# EAGLE schematic StationModule (EAGLE 7.2.0)
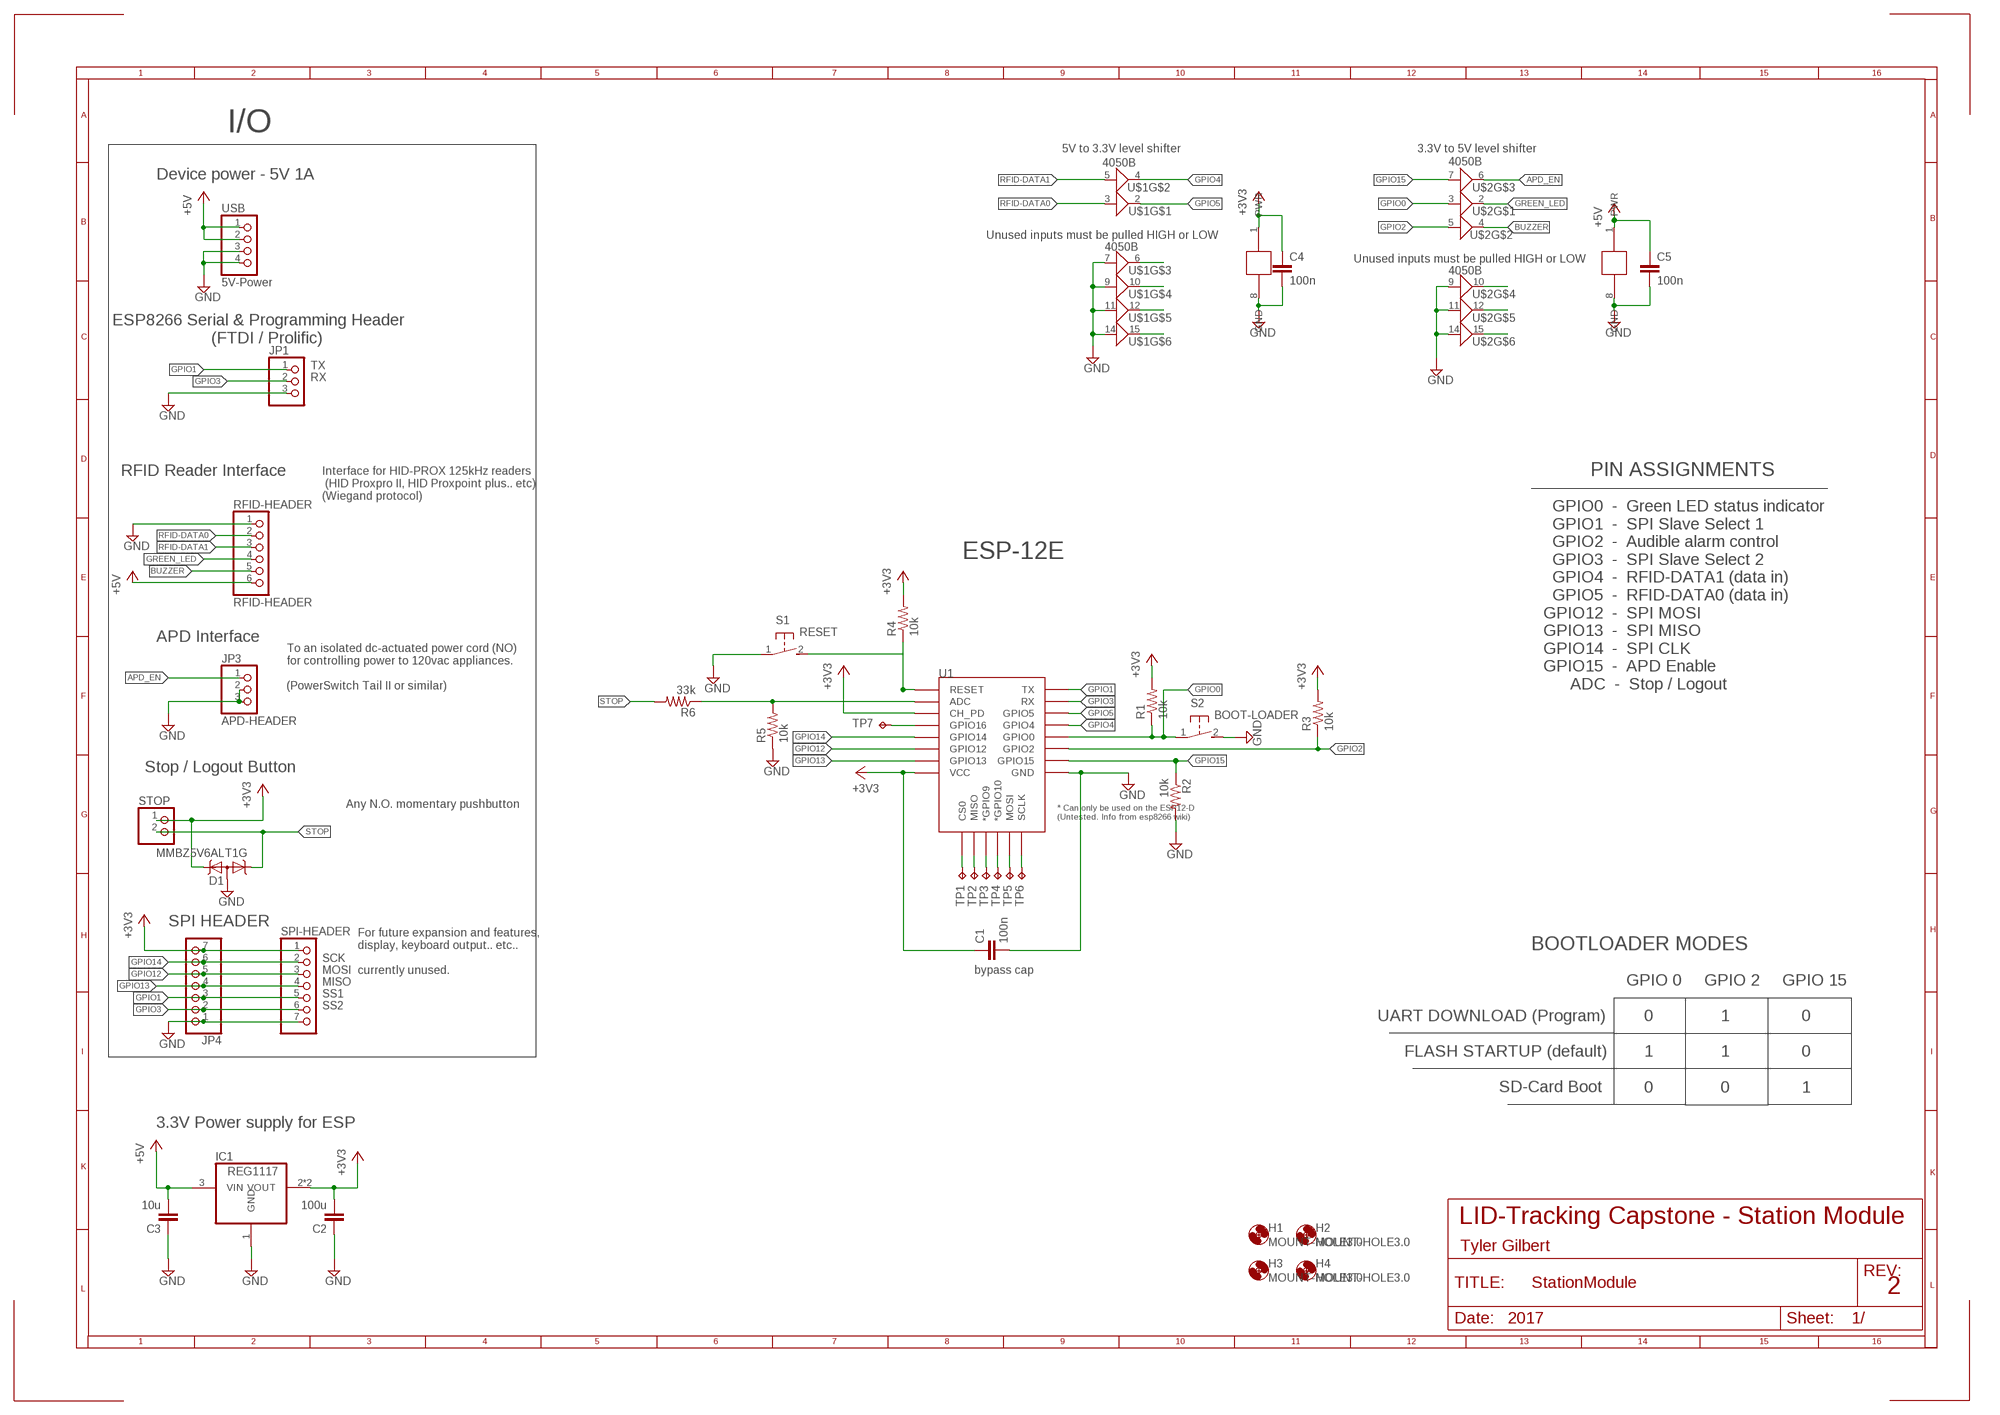
[diagram p0: schematic, sheet 1]

## Parts
C1  100n  C-EUC0805K  [C0805K]
C2  100u  C-EUC0805K  [C0805K]
C3  10u  C-EUC0805K  [C0805K]
C4  100n  C-EUC0805K  [C0805K]
C5  100n  C-EUC0805K  [C0805K]
D1  MMBZ5V6ALT1G  BAS40-06  [SOT23]
H1  MOUNT-HOLE3.0  [3,0]
H2  MOUNT-HOLE3.0  [3,0]
H3  MOUNT-HOLE3.0  [3,0]
H4  MOUNT-HOLE3.0  [3,0]
IC1  REG1117  [SOT223]
JP1  PINHD-1X3  [1X03]
JP3  APD-HEADER  PINHD-1X3  [1X03]
JP4  PINHD-1X7  [1X07]
R1  10k  R-US_R0805  [R0805]
R2  10k  R-US_R0805  [R0805]
R3  10k  R-US_R0805  [R0805]
R4  10k  R-US_R0805  [R0805]
R5  10k  R-US_R0805  [R0805]
R6  33k  R-US_R0805  [R0805]
RFID-HEADER  RFID-HEADER  PINHD-1X6  [1X06]
S1  RESET  DTSM-3  [DTSM-3]
S2  BOOT-LOADER  DTSM-3  [DTSM-3]
SPI-HEADER  PINHD-1X7  [1X07]
STOP  PINHD-1X2  [1X02]
TP1  TPB1,27  [B1,27]
TP2  TPB1,27  [B1,27]
TP3  TPB1,27  [B1,27]
TP4  TPB1,27  [B1,27]
TP5  TPB1,27  [B1,27]
TP6  TPB1,27  [B1,27]
TP7  TPB1,27  [B1,27]
U1  ESP12ESMD  [ESP12E-SMD]
U$1  4050B  [SOIC16N]
U$2  4050B  [SOIC16N]
USB  5V-Power  PINHD-1X4  [1X04]

## Nets
+3V3: C1.1 C2.2 C4.1 D1.2(K2) IC1.2(VOUT) IC1.4(VOUT) JP4.7 R1.2 R3.2 R4.2 SPI-HEADER.1 STOP.1 U1.CH_PD U1.VCC U$1.1(PWR)
+5V: C3.2 C5.1 IC1.3(VIN) RFID-HEADER.6 U$2.1(PWR) USB.1 USB.2
ADC: R5.2 R6.1 U1.ADC
APD_EN: JP3.1 U$2.6
BUZZER: RFID-HEADER.5 U$2.4
GND: C1.2 C2.1 C3.1 C4.2 C5.2 D1.3(AA) IC1.1(GND) JP1.3 JP3.2 JP3.3 JP4.1 R2.2 R5.1 RFID-HEADER.1 S1.1 S2.2 SPI-HEADER.7 U1.GND U$1.7 U$1.8(GND) U$1.9 U$1.11 U$1.14 U$2.8(GND) U$2.9 U$2.11 U$2.14 USB.3 USB.4
GPIO0: R1.1 S2.1 U1.GPIO0 U$2.3
GPIO1: JP1.1 JP4.3 SPI-HEADER.5 U1.TXD0(TX)
GPIO2: R3.1 U1.GPIO2 U$2.5
GPIO3: JP1.2 JP4.2 SPI-HEADER.6 U1.RXD0(RX)
GPIO4: U1.GPIO4 U$1.4
GPIO5: U1.GPIO5 U$1.2
GPIO12: JP4.5 SPI-HEADER.3 U1.GPIO12
GPIO13: JP4.4 SPI-HEADER.4 U1.GPIO13
GPIO14: JP4.6 SPI-HEADER.2 U1.GPIO14
GPIO15: R2.1 U1.GPIO15 U$2.7
GREEN_LED: RFID-HEADER.4 U$2.2
N$1: U$2.10
N$2: U$2.12
N$3: U$2.15
N$4: U$1.6
N$5: U$1.10
N$6: U$1.12
N$7: U$1.15
N$8: TP7.TP U1.GPIO16
N$9: TP1.TP U1.CS0
N$10: TP2.TP U1.MISO
N$11: TP3.TP U1.GPIO9(*GPIO9)
N$12: TP4.TP U1.GPIO10(*GPIO10)
N$13: TP5.TP U1.MOSI
N$15: TP6.TP U1.SCLK
RESET: R4.1 S1.2 U1.RESET
RFID-DATA0: RFID-HEADER.2 U$1.3
RFID-DATA1: RFID-HEADER.3 U$1.5
STOP: D1.1(K1) R6.2 STOP.2

## Notes on the sheet
- I/O
- 5V to 3.3V level shifter | 3.3V to 5V level shifter
- Device power - 5V 1A
- Unused inputs must be pulled HIGH or LOW
- Unused inputs must be pulled HIGH or LOW
- ESP8266 Serial & Programming Header
                         (FTDI / Prolific)
- TX
- RX
- RFID Reader Interface | PIN ASSIGNMENTS
- Interface for HID-PROX 125kHz readers
   (HID Proxpro II, HID Proxpoint plus.. etc)
  (Wiegand protocol)
- ESP-12E
- APD Interface
- To an isolated dc-actuated power cord (NO)
  for controlling power to 120vac appliances.
  
  (PowerSwitch Tail II or similar)
- GPIO0  -  Green LED status indicator
    GPIO1  -  SPI Slave Select 1
    GPIO2  -  Audible alarm control
    GPIO3  -  SPI Slave Select 2
    GPIO4  -  RFID-DATA1 (data in)
    GPIO5  -  RFID-DATA0 (data in)
  GPIO12  -  SPI MOSI
  GPIO13  -  SPI MISO
  GPIO14  -  SPI CLK
  GPIO15  -  APD Enable
        ADC  -  Stop / Logout
- Stop / Logout Button
- Any N.O. momentary pushbutton
- SPI HEADER
- BOOTLOADER MODES
- SCK
- MOSI
- For future expansion and features,
  display, keyboard output.. etc..
  
  currently unused.
- bypass cap
- MISO
- SS1
- SS2
- UART DOWNLOAD (Program)
  
        FLASH STARTUP (default)
  
                             SD-Card Boot
- GPIO 0     GPIO 2     GPIO 15
  
      0               1                0
  
      1               1                0
  
      0               0                1
- 3.3V Power supply for ESP

## Library data of the parts
C1-C5 = rcl:C-EU: CAPACITOR, European symbol
D1 = diode:BAS40-06: Silicon Schottky Diodes General-purpose diode for high-speed switching
H1-H4 = holes:MOUNT-HOLE: MOUNTING HOLE with drill center marker
IC1 = burr-brown:REG1117: 800mA and 1A Low Dropout (LDO) Positive Regulator 1.8V, 2.5V, 2.85V, 3.3V, 5V, and Adj; MPN: REG1117; OC_FARNELL: 1097566; OC_NEWARK: 14P6981
JP1 = pinhead+:PINHD-1X3: PIN HEADER
JP3 = pinhead:PINHD-1X3: PIN HEADER
JP4 SPI-HEADER = pinhead+:PINHD-1X7: PIN HEADER
R1-R6 = rcl:R-US_: RESISTOR, American symbol
RFID-HEADER = pinhead+:PINHD-1X6: PIN HEADER
S1 S2 = switch-tact:DTSM-3
STOP = pinhead+:PINHD-1X2: PIN HEADER
TP1-TP7 = testpad:TP: Test pad
U1 = esp8266modules:ESP12E: ESP12E Module
U$1 U$2 = Ty2017:4050B
USB = pinhead+:PINHD-1X4: PIN HEADER